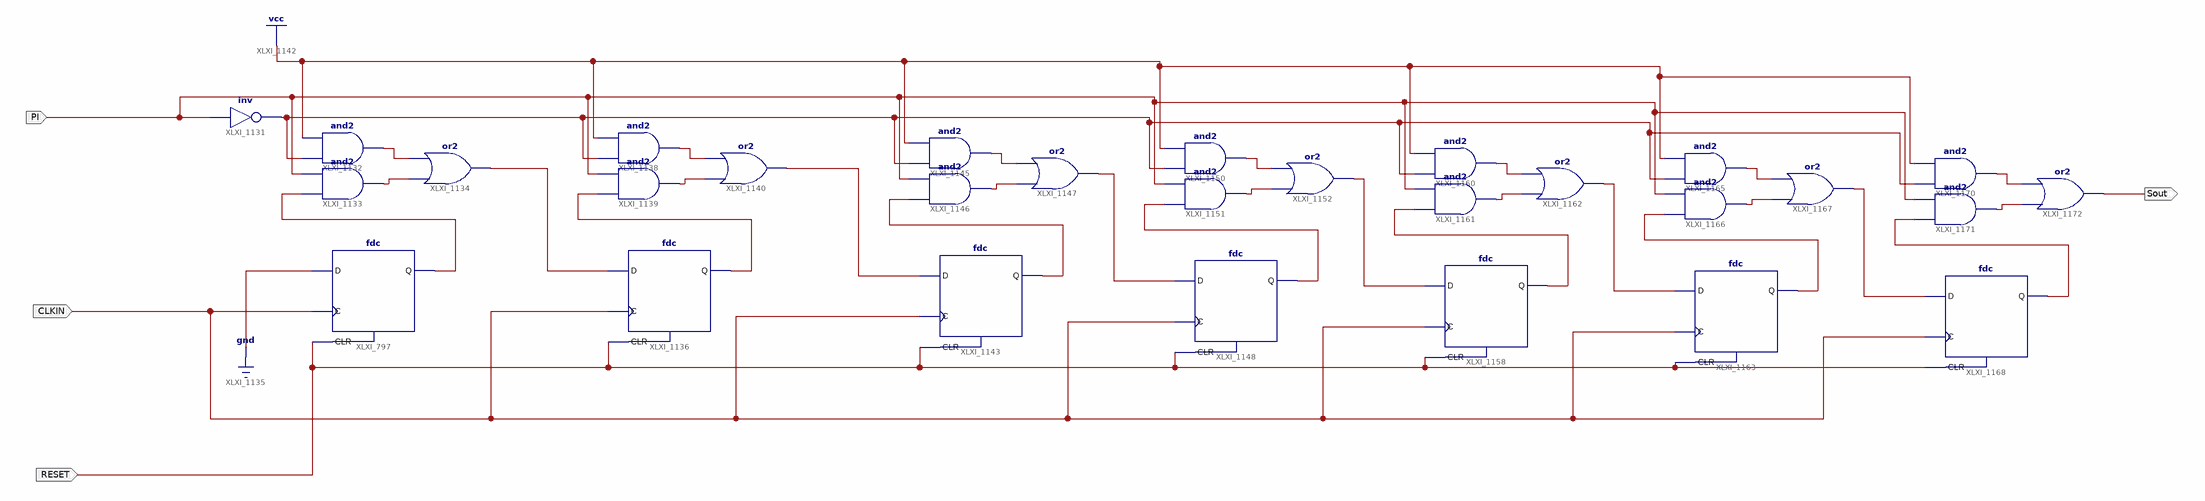
[diagram p0: schematic sheet 1]
// Xilinx ISE schematic PISO.sch (xc9500) as structural Verilog: 29 symbols, 4 ports
module PISO (
  input  CLKIN,
  input  PI,
  input  RESET,
  output Sout
);

  wire XLXN_5, XLXN_6, XLXN_9, XLXN_10, XLXN_17, XLXN_19, XLXN_20, XLXN_25, XLXN_30, XLXN_32, XLXN_33,
       XLXN_34, XLXN_39, XLXN_41, XLXN_42, XLXN_43, XLXN_57, XLXN_59, XLXN_60, XLXN_61, XLXN_66, XLXN_68,
       XLXN_69, XLXN_70, XLXN_75, XLXN_77, XLXN_78, XLXN_79;

  fdc XLXI_797 (.C(CLKIN), .CLR(RESET), .D(1'b0), .Q(XLXN_9));
  not XLXI_1131 (XLXN_10, PI);
  and XLXI_1132 (XLXN_5, XLXN_10, 1'b1);
  and XLXI_1133 (XLXN_6, XLXN_9, PI);
  or XLXI_1134 (XLXN_25, XLXN_6, XLXN_5);
  fdc XLXI_1136 (.C(CLKIN), .CLR(RESET), .D(XLXN_25), .Q(XLXN_20));
  and XLXI_1138 (XLXN_17, XLXN_10, 1'b1);
  and XLXI_1139 (XLXN_19, XLXN_20, PI);
  or XLXI_1140 (XLXN_34, XLXN_19, XLXN_17);
  fdc XLXI_1143 (.C(CLKIN), .CLR(RESET), .D(XLXN_34), .Q(XLXN_33));
  and XLXI_1145 (XLXN_30, XLXN_10, 1'b1);
  and XLXI_1146 (XLXN_32, XLXN_33, PI);
  or XLXI_1147 (XLXN_43, XLXN_32, XLXN_30);
  fdc XLXI_1148 (.C(CLKIN), .CLR(RESET), .D(XLXN_43), .Q(XLXN_42));
  and XLXI_1150 (XLXN_39, XLXN_10, 1'b1);
  and XLXI_1151 (XLXN_41, XLXN_42, PI);
  or XLXI_1152 (XLXN_61, XLXN_41, XLXN_39);
  fdc XLXI_1158 (.C(CLKIN), .CLR(RESET), .D(XLXN_61), .Q(XLXN_60));
  and XLXI_1160 (XLXN_57, XLXN_10, 1'b1);
  and XLXI_1161 (XLXN_59, XLXN_60, PI);
  or XLXI_1162 (XLXN_70, XLXN_59, XLXN_57);
  fdc XLXI_1163 (.C(CLKIN), .CLR(RESET), .D(XLXN_70), .Q(XLXN_69));
  and XLXI_1165 (XLXN_66, XLXN_10, 1'b1);
  and XLXI_1166 (XLXN_68, XLXN_69, PI);
  or XLXI_1167 (XLXN_79, XLXN_68, XLXN_66);
  fdc XLXI_1168 (.C(CLKIN), .CLR(RESET), .D(XLXN_79), .Q(XLXN_78));
  and XLXI_1170 (XLXN_75, XLXN_10, 1'b1);
  and XLXI_1171 (XLXN_77, XLXN_78, PI);
  or XLXI_1172 (Sout, XLXN_77, XLXN_75);
endmodule
